# Altium schematic sheet FAT34p.SchDoc
size A4
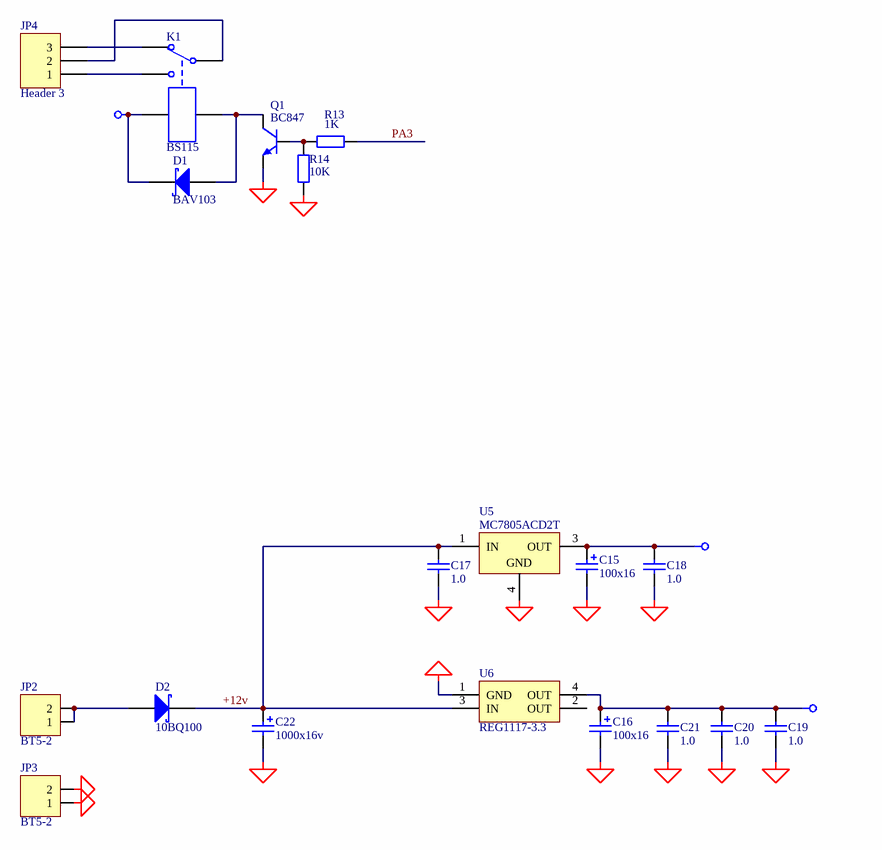
[diagram p0: FAT34p.SchDoc]

## Parts
C15  value 100x16  [el3]
C16  value 100x16  [el3]
C17  value 1.0  [_1206]  (hidden comment: Cap)
C18  value 1.0  [_1206]  (hidden comment: Cap)
C19  value 1.0  [_1206]  (hidden comment: Cap)
C20  value 1.0  [_1206]  (hidden comment: Cap)
C21  value 1.0  [_1206]  (hidden comment: Cap)
C22  value 1000x16v  [el5]
D1  BAV103  [_1206d]
D2  10BQ100  [D_6_3]
JP2  BT5-2  [BT5-2-1]
JP3  BT5-2  [BT5-2-1]
JP4  Header 3  [BT5-3]
K1  BS115  [BS115]
Q1  BC847  [SO-G3]
R13  value 1K  [_1206]  (hidden comment: Res2)
R14  value 10K  [_1206]  (hidden comment: Res2)
U5  MC7805ACD2T  [D2PAK]
U6  REG1117-3.3  [SIP-G3/E13]

## Nets
+3v3: C16.1 C19.2 C20.2 C21.2 U6.4(OUT)
+5v: C15.1 C18.2 U5.3(OUT)
+12v: C17.2 C22.1 D1.2(K) D2.2(K) K1.5 U5.1(IN) U6.3(IN)
GND: C15.2 C16.2 C17.1 C18.1 C19.1 C20.1 C21.1 C22.2 JP3.1 JP3.2 Q1.2(E) R14.2 U5.4(GND) U6.1(GND)
PA3: R13.2
NetD1_1: D1.1(A) K1.4 Q1.3(C)
NetD2_1: D2.1(A) JP2.1 JP2.2
NetJP4_1: JP4.1 K1.3
NetJP4_2: JP4.2 K1.1
NetJP4_3: JP4.3 K1.2
NetQ1_1: Q1.1(B) R13.1 R14.1

Not connected (* = marked no-connect by the designer): U6 2(OUT)

## Library data of the parts
C15 C16 = Cap Pol: Polarized Capacitor (Radial); Manufacturer: Generic Components; Class I: Passive; Published: 8-Jun-2000; Revision: July-2002: Re-released for DXP Platform.; Publisher: Altium Limited; Class II: Capacitor
C17-C21 = Cap: Capacitor; Manufacturer: Generic Components; Class I: Passive; Published: 8-Jun-2000; Revision: July-2002: Re-released for DXP Platform.; Publisher: Altium Limited; Class II: Capacitor
C22 = Cap Pol1: Polarized Capacitor (Radial); Manufacturer: Generic Components; Class I: Passive; Published: 8-Jun-2000; Revision: July-2002: Re-released for DXP Platform.; Publisher: Altium Limited; Class II: Capacitor
D1 D2 = 10BQ015: Schottky Rectifier; Manufacturer: International Rectifier; Revision 1: 10-July-2000: SIM Model Added.; Revision 2: July-2002: Re-released for DXP Platform.; Class I: Discrete; Class II: Rectifier - Schottky; Published: 8-Jun-2000; Datasheet: Latest Revision: PD-2.396A; Package Reference: DO-214AA; Publisher: Altium Limited
JP2 JP3 = BT5-2: Header, 3-Pin; Manufacturer: Generic Components; Class I: Connector; Revision: July-2002: Re-released for DXP Platform.; Publisher: Altium Limited
JP4 = Header 3: Header, 3-Pin; Manufacturer: Generic Components; Class I: Connector; Revision: July-2002: Re-released for DXP Platform.; Publisher: Altium Limited
K1 = BS115: Single-Pole Dual-Throw Relay; Manufacturer: Generic Components; Class I: Electro-mechanical; Published: 24-Mar-1999; Revision: July-2002: Re-released for DXP Platform.; Publisher: Altium Limited; Class II: Relay
Q1 = BC847ALT1: General Purpose Transistor NPN Silicon; Manufacturer: Motorola; Package Information: Latest Revision: 1997; Class I: Discrete; Class II: BJT - Low Power; Published: 29-Sep-2000; Revision: July-2002: Re-released for DXP Platform.; Datasheet: Latest Revision: 1997; Package Reference: 318-08; Publisher: Altium Limited
R13 R14 = Res2: Resistor; Manufacturer: Generic Components; Class I: Passive; Published: 8-Jun-2000; Revision: July-2002: Re-released for DXP Platform.; Publisher: Altium Limited; Class II: Resistor
U5 = MC7805ACD2T: Three-Terminal Positive Voltage Regulator; Manufacturer: ON Semiconductor; Package Information: Latest Revision: 1997; Class I: Power Management; Note: Pin 2 is electrically connected to Pin 4; Pin 2 is trimmed and not drawn;; Published: 15-Apr-2002; Datasheet: Latest Revision: 1997; Package Reference: 936-03; Publisher: Altium Limited; Class II: Voltage Regulator
U6 = REG1117-3.3: 800mA and 1A Low Dropout Positive Regulator 2.85V, 3.3V, 5V, and Adjustable; Manufacturer: Burr-Brown; Package Information: Latest Revision: Rev. C; Class I: Power Management; Class II: Voltage Regulator; Published: 8-Jun-2000; Revision: July-2002: Re-released for DXP Platform.; Datasheet: Latest Revision: Sep-1997; Package Reference: ZZ311; Publisher: Altium Limited